# EAGLE schematic LEDLightSticks_V2--02--Power_Dist_PCB_v3 (EAGLE 9.7.0)
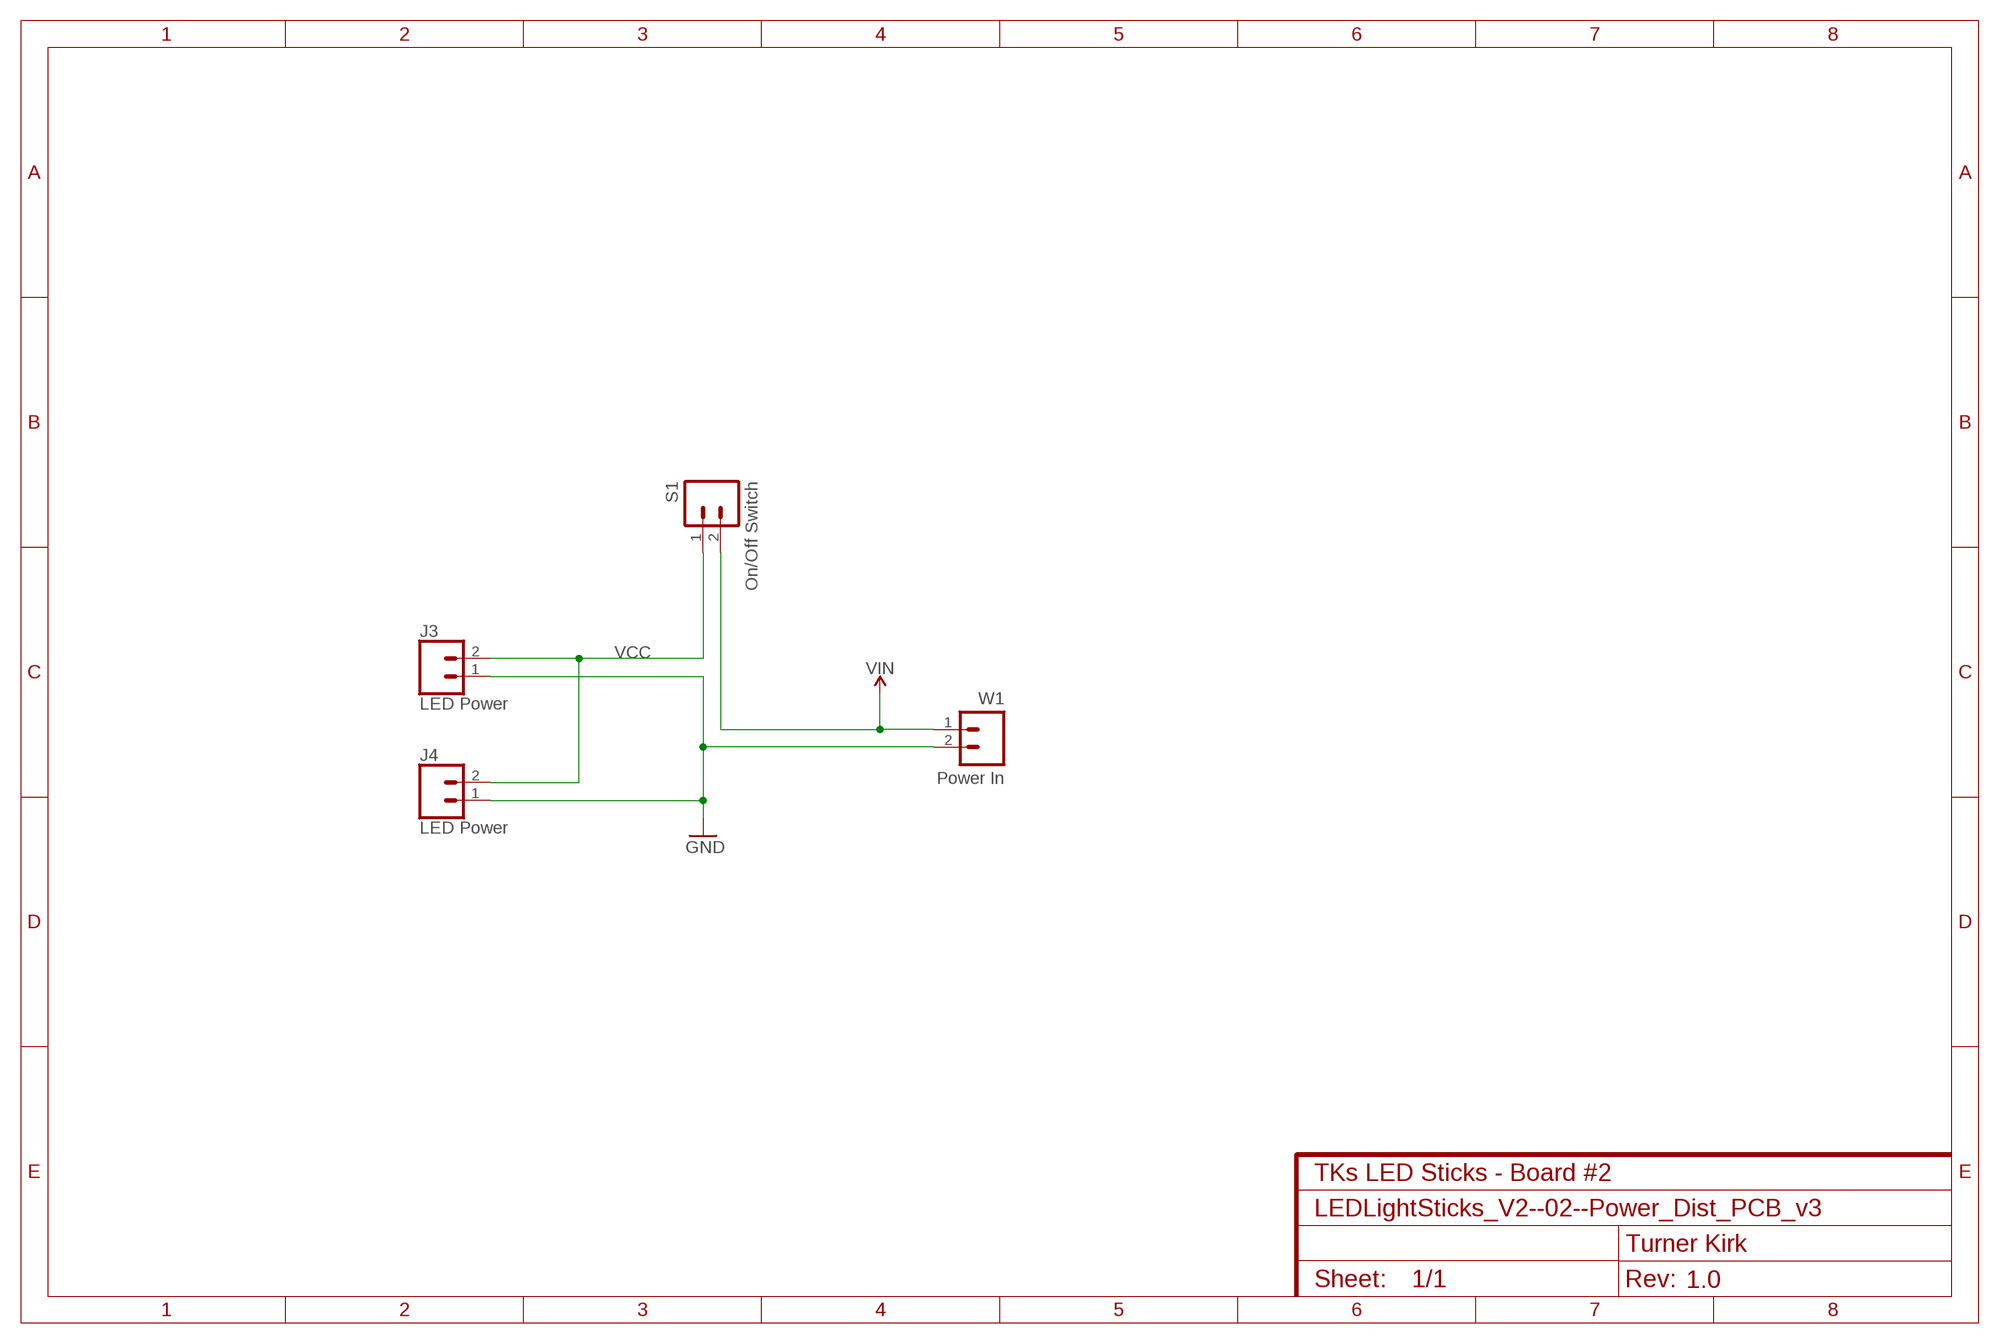
[diagram p0: schematic, sheet 1]
FRAME1 (FRAME-A4L): CNAME: TKs LED Sticks - Board #2; CREVISION: 1.0; DESIGNER: Turner Kirk

## Parts
J3  LED Power  CONN_02JST-2.5-PTH-XH-RA  [JST-2-PTH-XH-RA]
J4  LED Power  CONN_02JST-2.5-PTH-XH-RA  [JST-2-PTH-XH-RA]
S1  On/Off Switch  CONN_02PTH-1.5MM_DRILL  [1X02_1.5MM]
W1  Power In  CONN_02PTH-1.5MM_DRILL  [1X02_1.5MM]

## Nets
GND: J3.1 J4.1 W1.2
VCC: J3.2 J4.2 S1.1
VIN: S1.2 W1.1

## Library data of the parts
J3 J4 S1 W1 = LED_Light_Sticks_Library:CONN_02: Multi connection point. Often used as Generic Header-pin footprint for 0.1 inch spaced/style header connections On any of the 0.1 inch spaced packages, you can populate with these: Break Away Headers - Straight <https://www.sparkfun.com/products/116> (PRT-00116) Break Away Male Headers - Right Angle <https://www.sparkfun.com/products/553> (PRT-00553) Female Headers <https://www.sparkfun.com/products/115> (PRT-00115) Break Away Headers - Machine Pin <https://www.sparkfun.com/products/117> (PRT-00117) Break Away Female Headers - Swiss Machine Pin <https://www.sparkfun.com/products/743> (PRT-00743) For SCREWTERMINALS and SPRING TERMINALS visit here: Screw Terimnals on SparkFun.com <https://www.sparkfun.com/search/results?term=Screw+Terminals> (5mm/3.5mm/2.54mm spacing) This device is also useful as a general connection point to wire up your design to another part of your project. Our various solder wires solder well into these plated through hole pads. Hook-Up Wire - Assortment (Stranded, 22 AWG) <https://www.sparkfun.com/products/11375> (PRT-11375) Hook-Up Wire - Assortment (Solid Core, 22 AWG) <https://www.sparkfun.com/products/11367> (PRT-11367) View the entire wire category on our website here <https://www.sparkfun.com/categories/141> Special notes: Molex polarized connector foot print use with: PRT-08233 with associated crimp pins and housings. 2.54_SCREWTERM for use with PRT-10571. 3.5mm Screw Terminal footprints for PRT-08084 5mm Screw Terminal footprints for use with PRT-08432